# Altium schematic sheet Server USB.schdoc
size 426 x 297 mm
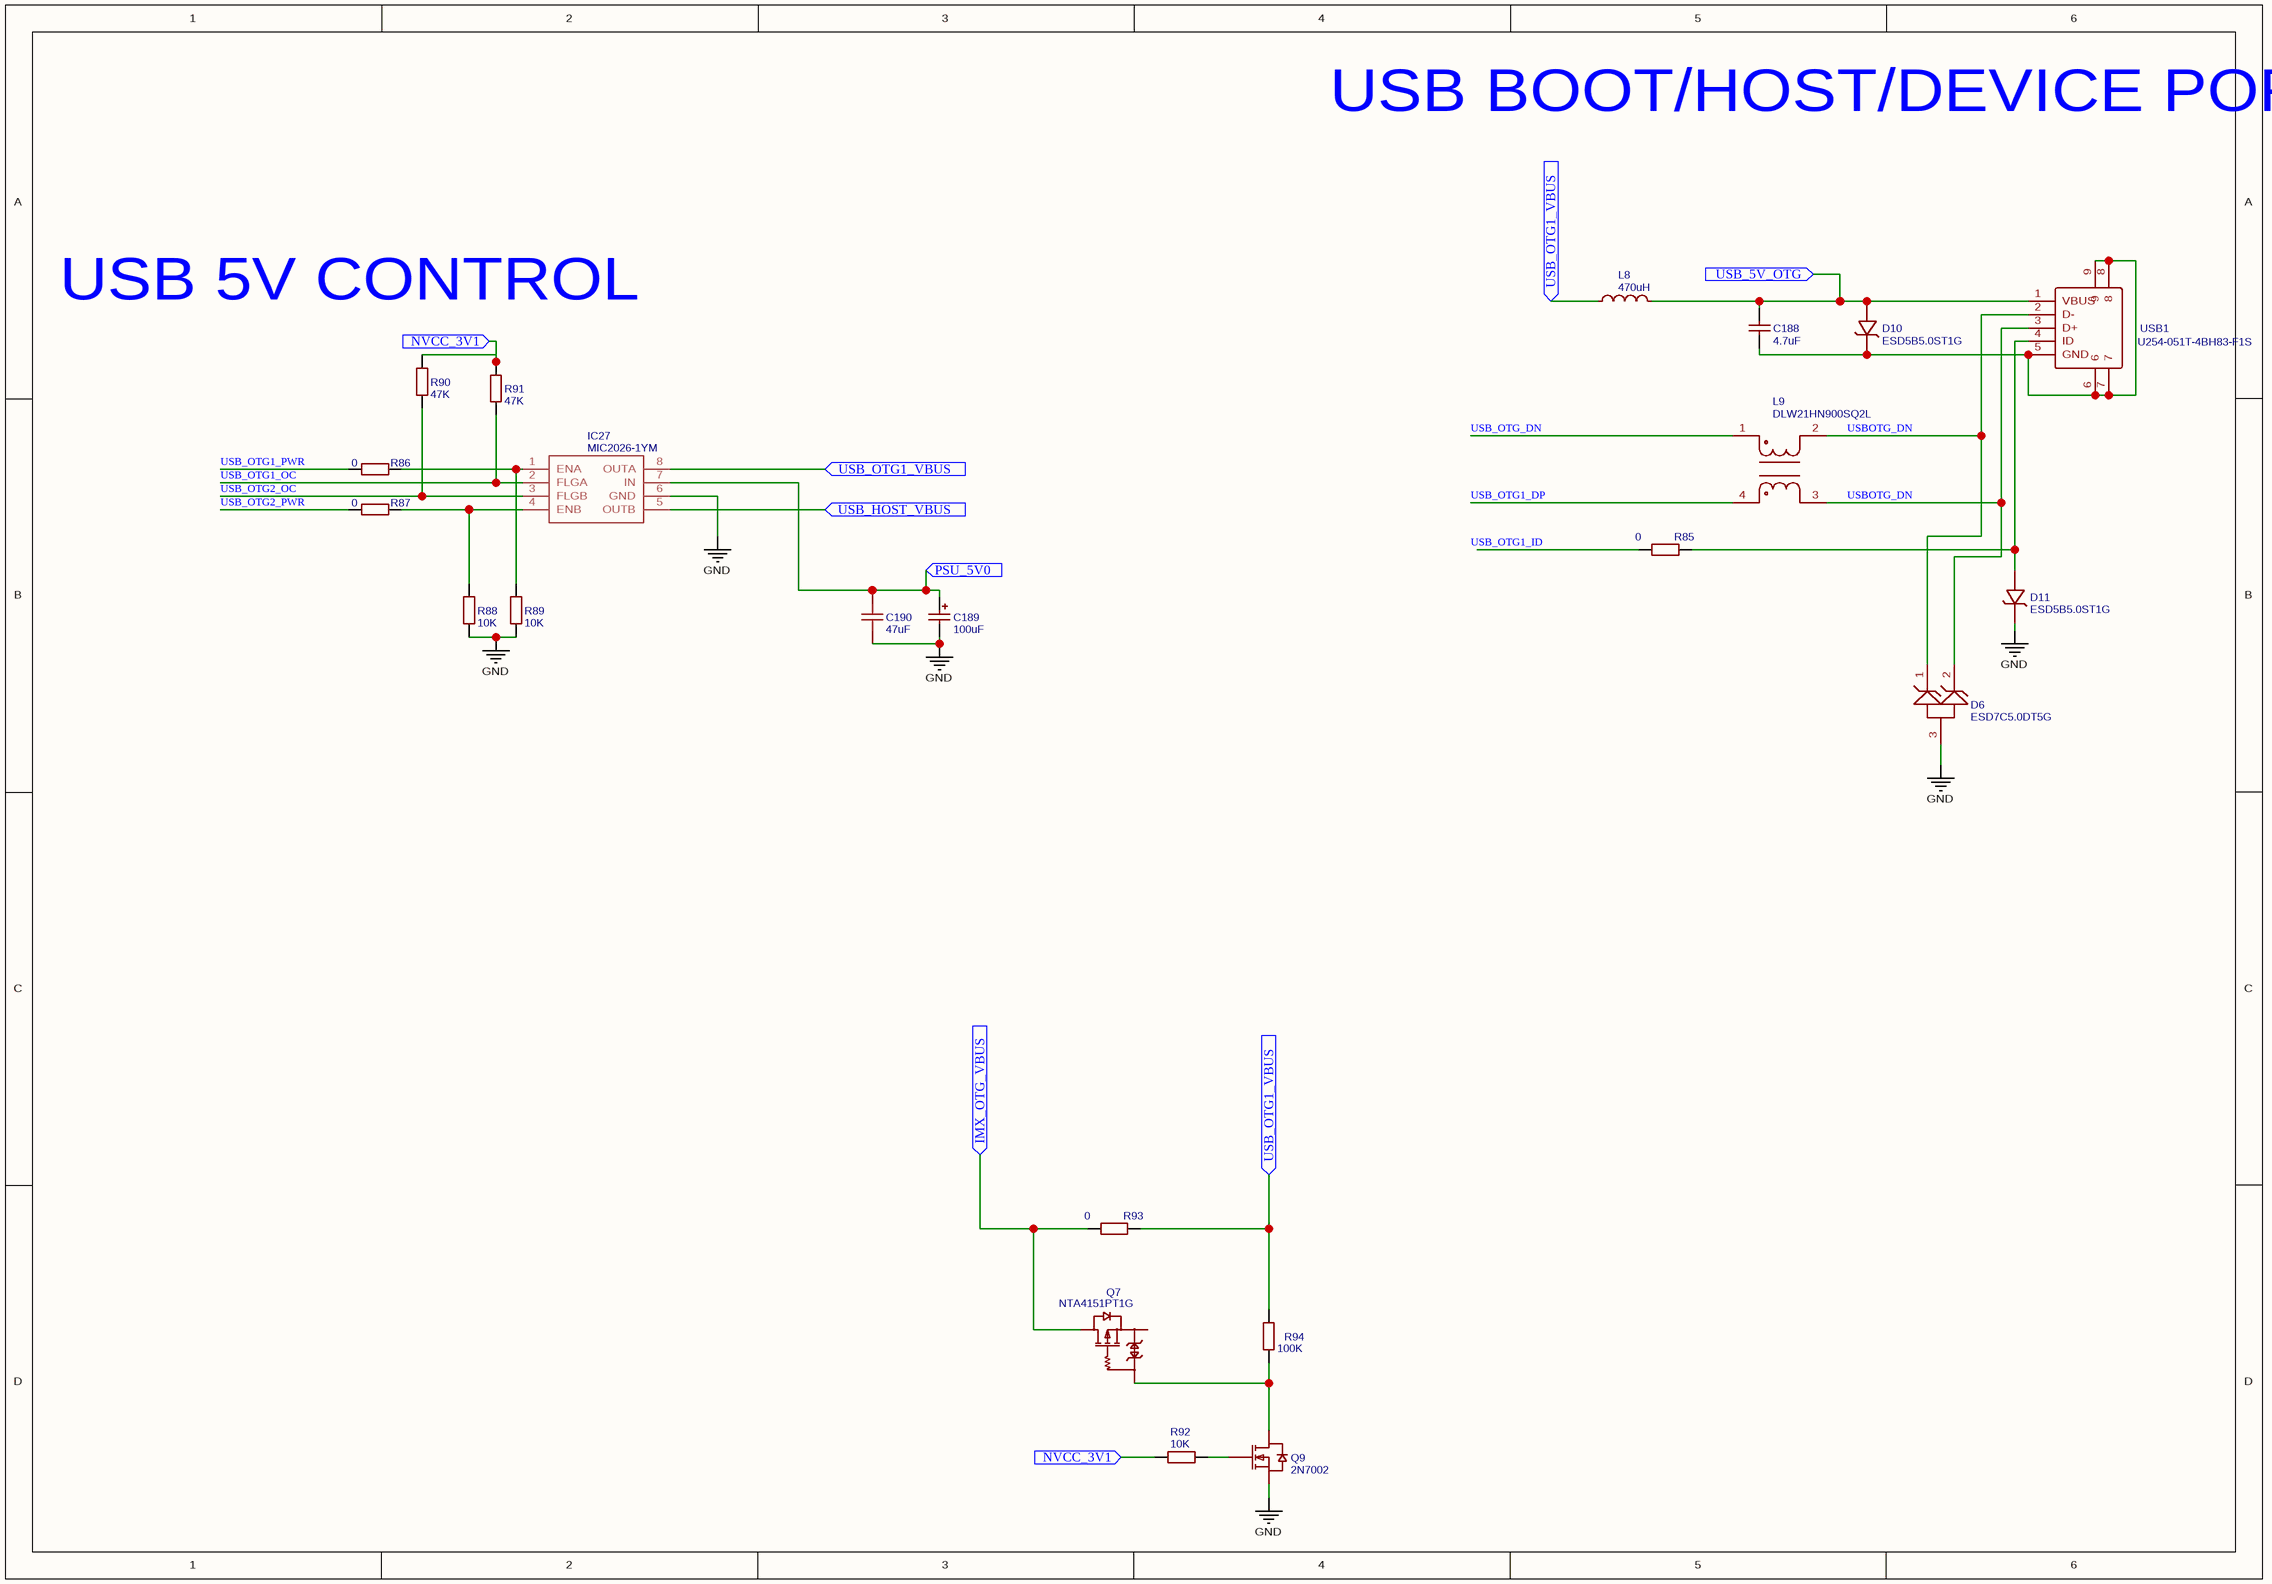
[diagram p0: Server USB.schdoc]

## Parts
C188  4.7uF  [C0402]
C189  100uF  [CAP-SMD_L7.3-W4.3-R-RD]
C190  47uF  [C1206]
D6  ESD7C5.0DT5G  [ONSC-SOT-723-3-631AA-01_V]
D10  ESD5B5.0ST1G  [SOD-523_L1.2-W0.8-LS1.6-RD]
D11  ESD5B5.0ST1G  [SOD-523_L1.2-W0.8-LS1.6-RD]
IC27  MIC2026-1YM  [SOIC127P599X173-8N]
L8  470uH  [IND-SMD_L12.5-W12.5]
L9  DLW21HN900SQ2L  [FILTER-SMD_4P-L2.0-W1.2-BL_DLW21H]
Q7  NTA4151PT1G  [SOT-416_L1.6-W0.8-P1.00-LS1.6-BR]
Q9  2N7002  [SOT-23-3_L2.9-W1.3-P1.90-LS2.4-BR]
R85  0  [R0402]
R86  0  [R0402]
R87  0  [R0402]
R88  10K  [R0603]
R89  10K  [R0603]
R90  47K  [R0603]
R91  47K  [R0603]
R92  10K  [R0603]
R93  0  [R0402]
R94  100K  [R0603]
USB1  U254-051T-4BH83-F1S  [MICRO-USB-SMD_U254-051T-4BH83-F1S]

## Ports
IMX_OTG_VBUS (in), NVCC_3V1 (in), PSU_5V0 (in), USB_5V_OTG (in), USB_HOST_VBUS (in), USB_OTG1_VBUS (in)

## Nets
GND: C189.2 C190.1 D6.3(A) D11.1(C) IC27.6(GND) Q9.2(S) R88.1 R89.1
IMX_OTG_VBUS: Q7.3(D) R93.1 ; port IMX_OTG_VBUS
NVCC_3V1: R90.2 R91.2 R92.2 ; port NVCC_3V1
PSU_5V0: C189.1 C190.2 IC27.7(IN) ; port PSU_5V0
USB_5V_OTG: C188.2 D10.2(A) L8.2 USB1.1(VBUS) ; port USB_5V_OTG
USB_HOST_VBUS: IC27.5(OUTB) ; port USB_HOST_VBUS
USB_OTG1_DP: L9.4
USB_OTG1_OC: IC27.2(FLGA) R91.1
USB_OTG1_PWR: R86.1
USB_OTG1_VBUS: IC27.8(OUTA) L8.1 R93.2 R94.2 ; port USB_OTG1_VBUS
USB_OTG2_OC: IC27.3(FLGB) R90.1
USB_OTG2_PWR: R87.1
USB_OTG_DN: L9.1
USBOTG_DN: D6.1(K1) D6.2(K2) L9.2 L9.3 USB1.2(D-) USB1.3(D+)
NetC188_1: C188.1 D10.1(C) USB1.5(GND) USB1.6 USB1.7 USB1.8 USB1.9
NetD11_2: D11.2(A) R85.2 USB1.4(ID)
NetIC27_1: IC27.1(ENA) R86.2 R89.2
NetIC27_4: IC27.4(ENB) R87.2 R88.2
NetQ7_1: Q7.1(G) Q9.3(D) R94.1
NetQ9_1: Q9.1(G) R92.1

Not connected (* = marked no-connect by the designer): Q7 2(S); R85 1

## Notes on the sheet
- USB BOOT/HOST/DEVICE PORT
- USB 5V CONTROL
- Labels drawn without touching a wire or pin: USB_OTG1_ID

## Library data of the parts
C188 = 4.7uF: BOM_Manufacturer Part: CL05A475MP5NRNC; BOM_Manufacturer: SAMSUNG; nameAlias: Capacitance; SMT Type: Basic; BOM_Supplier: LCSC; BOM_LCSC Assembly: Yes; BOM_Supplier Part: C23733; spicePre: C; spiceSymbolName: CL05A475MP5NRNC
C189 = 100uF: BOM_Manufacturer: AVX; BOM_Manufacturer Part: TAJE107M025RNJ; nameAlias: Capacitance; SMT Type: Extend; BOM_Supplier: LCSC; BOM_Supplier Part: C7230; BOM_LCSC Assembly: Yes; spicePre: C; spiceSymbolName: TAJE107M025RNJ
C190 = 47uF: BOM_Manufacturer: SAMSUNG; BOM_Manufacturer Part: CL31A476MPHNNNE; nameAlias: Capacitance; SMT Type: Basic; BOM_Supplier: LCSC; BOM_Supplier Part: C96123; BOM_LCSC Assembly: Yes; spicePre: C; spiceSymbolName: CL31A476MPHNNNE
D6 = ESD7C5.0DT5G: description: Transient Voltage Suppressor, Micro-Packaged Diode for ESD Protection, 3-Pin SOT-723, Pb-Free, Tape and Reel; spicePre: D; spiceSymbolName: ESD7C5.0DT5G
D10 D11 = ESD5B5.0ST1G: BOM_Manufacturer: ON; SMT Type: Extend; BOM_Supplier: LCSC; BOM_Manufacturer Part: ESD5B5.0ST1G; BOM_Supplier Part: C93623; BOM_LCSC Assembly: Yes; spicePre: D; spiceSymbolName: ESD5B5.0ST1G
IC27 = MIC2026-1YM: Contributor: Ke'Ondrae_Mell; spicePre: I; spiceSymbolName: MIC2026-1YM
L8 = 470uH: BOM_Manufacturer: Sunlord; BOM_Manufacturer Part: SWRB1205S-471MT; nameAlias: Inductance; Contributor: LCSC; SMT Type: Extend; BOM_Supplier: LCSC; BOM_Supplier Part: C169393; BOM_LCSC Assembly: Yes; spicePre: L; spiceSymbolName: SWRB1205S-471MT
L9 = DLW21HN900SQ2L: BOM_Manufacturer: MuRata; nameAlias: Value(H); Value: 90Ω; BOM_Supplier: LCSC; BOM_Manufacturer Part: DLW21HN900SQ2L; BOM_Supplier Part: C97235; spicePre: L; spiceSymbolName: DLW21HN900SQ2L
Q7 = NTA4151PT1G: BOM_Manufacturer: ON; SMT Type: Extend; BOM_Supplier: LCSC; BOM_Manufacturer Part: NTA4151PT1G; image: //image.lceda.cn/szlcsc/C54876.jpg; BOM_Supplier Part: C54876; BOM_LCSC Assembly: Yes; spicePre: Q; spiceSymbolName: NTA4151PT1G
Q9 = 2N7002: BOM_Manufacturer: CJ; SMT Type: Basic; BOM_Supplier: LCSC; BOM_Manufacturer Part: 2N7002; BOM_LCSC Assembly: Yes; image: //image.lceda.cn/szlcsc/C8545.jpg; BOM_Supplier Part: C8545; spicePre: Q; spiceSymbolName: 2N7002
R85-R87 R93 = 0: BOM_Manufacturer: KOA; BOM_Manufacturer Part: RK73Z1ETTP; nameAlias: Resistance (Ohms); BOM_Supplier: LCSC; BOM_Supplier Part: C131359; spicePre: R; spiceSymbolName: RK73Z1ETTP
R88 R89 R92 = 10K: BOM_Manufacturer: UniOhm; BOM_Manufacturer Part: 0603WAF1002T5E; nameAlias: Resistance (Ohms); SMT Type: Basic; BOM_Supplier: LCSC; BOM_LCSC Assembly: Yes; BOM_Supplier Part: C25804; spicePre: R; spiceSymbolName: 0603WAF1002T5E
R90 R91 = 47K: BOM_Manufacturer: UniOhm; BOM_Manufacturer Part: 0603WAF4702T5E; nameAlias: Resistance (Ohms); SMT Type: Basic; BOM_Supplier: LCSC; BOM_LCSC Assembly: Yes; BOM_Supplier Part: C25819; spicePre: R; spiceSymbolName: 0603WAF4702T5E
R94 = 100K: BOM_Manufacturer: UniOhm; BOM_Manufacturer Part: 0603WAF1003T5E; nameAlias: Resistance (Ohms); SMT Type: Basic; BOM_Supplier: LCSC; BOM_LCSC Assembly: Yes; BOM_Supplier Part: C25803; spicePre: R; spiceSymbolName: 0603WAF1003T5E
USB1 = U254-051T-4BH83-F1S: BOM_Manufacturer: XKB Enterprise; Contributor: LCSC; BOM_Supplier: LCSC; BOM_Supplier Part: C397452; BOM_Manufacturer Part: U254-051T-4BH83-F1S; spicePre: U; spiceSymbolName: U254-051T-4BH83-F1S